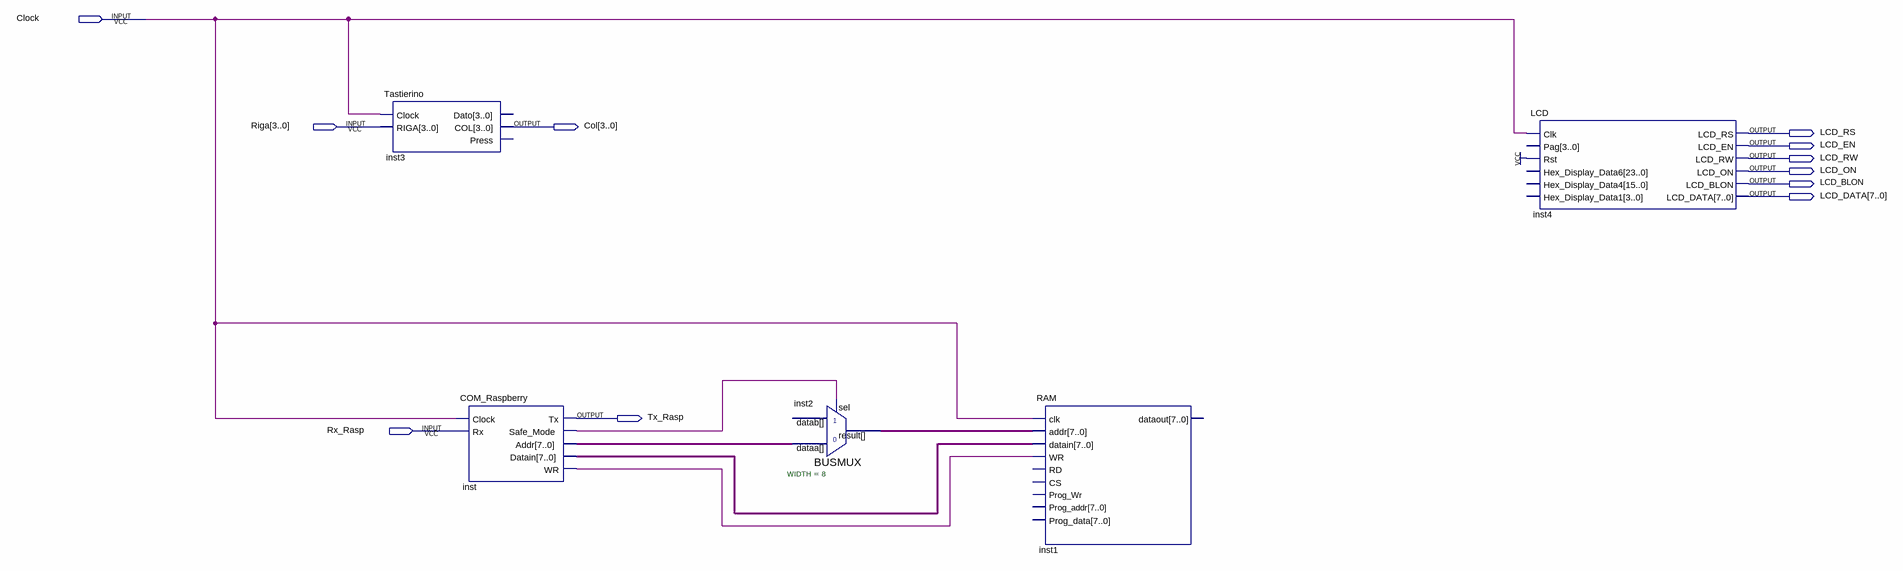
[diagram p0: schematic sheet]
// Quartus schematic Gestione_Accessi.bdf as structural Verilog: 5 symbols, 11 pins
module Gestione_Accessi (
  input  Clock,
  input  [3:0] Riga,
  input  Rx_Rasp,
  output [3:0] Col,
  output LCD_RS,
  output LCD_EN,
  output LCD_RW,
  output LCD_ON,
  output LCD_BLON,
  output [7:0] LCD_DATA,
  output Tx_Rasp
);

  wire inst_safe_mode, inst_wr;
  wire [7:0] inst2_result, inst_addr, inst_datain;

  Tastierino inst3 (.Clock(Clock), .RIGA(Riga), .COL(Col));  // open: Dato, Press
  COM_Raspberry inst (
    .Clock(Clock), .Rx(Rx_Rasp), .Tx(Tx_Rasp), .Safe_Mode(inst_safe_mode), .Addr(inst_addr),
    .Datain(inst_datain), .WR(inst_wr));
  BUSMUX #(.WIDTH(8)) inst2 (.sel(inst_safe_mode), .dataa(inst_addr), .result(inst2_result));  // open: datab
  RAM inst1 (
    .clk(Clock), .addr(inst2_result), .datain(inst_datain), .WR(inst_wr));  // open: RD, CS, Prog_Wr, Prog_addr, Prog_data, dataout
  LCD inst4 (
    .Clk(Clock), .Rst(1'b1), .LCD_RS(LCD_RS), .LCD_EN(LCD_EN), .LCD_RW(LCD_RW), .LCD_ON(LCD_ON),
    .LCD_BLON(LCD_BLON), .LCD_DATA(LCD_DATA));  // open: Pag, Hex_Display_Data6, Hex_Display_Data4, Hex_Display_Data1
endmodule
